# EAGLE schematic untitled (EAGLE 7.2.0)
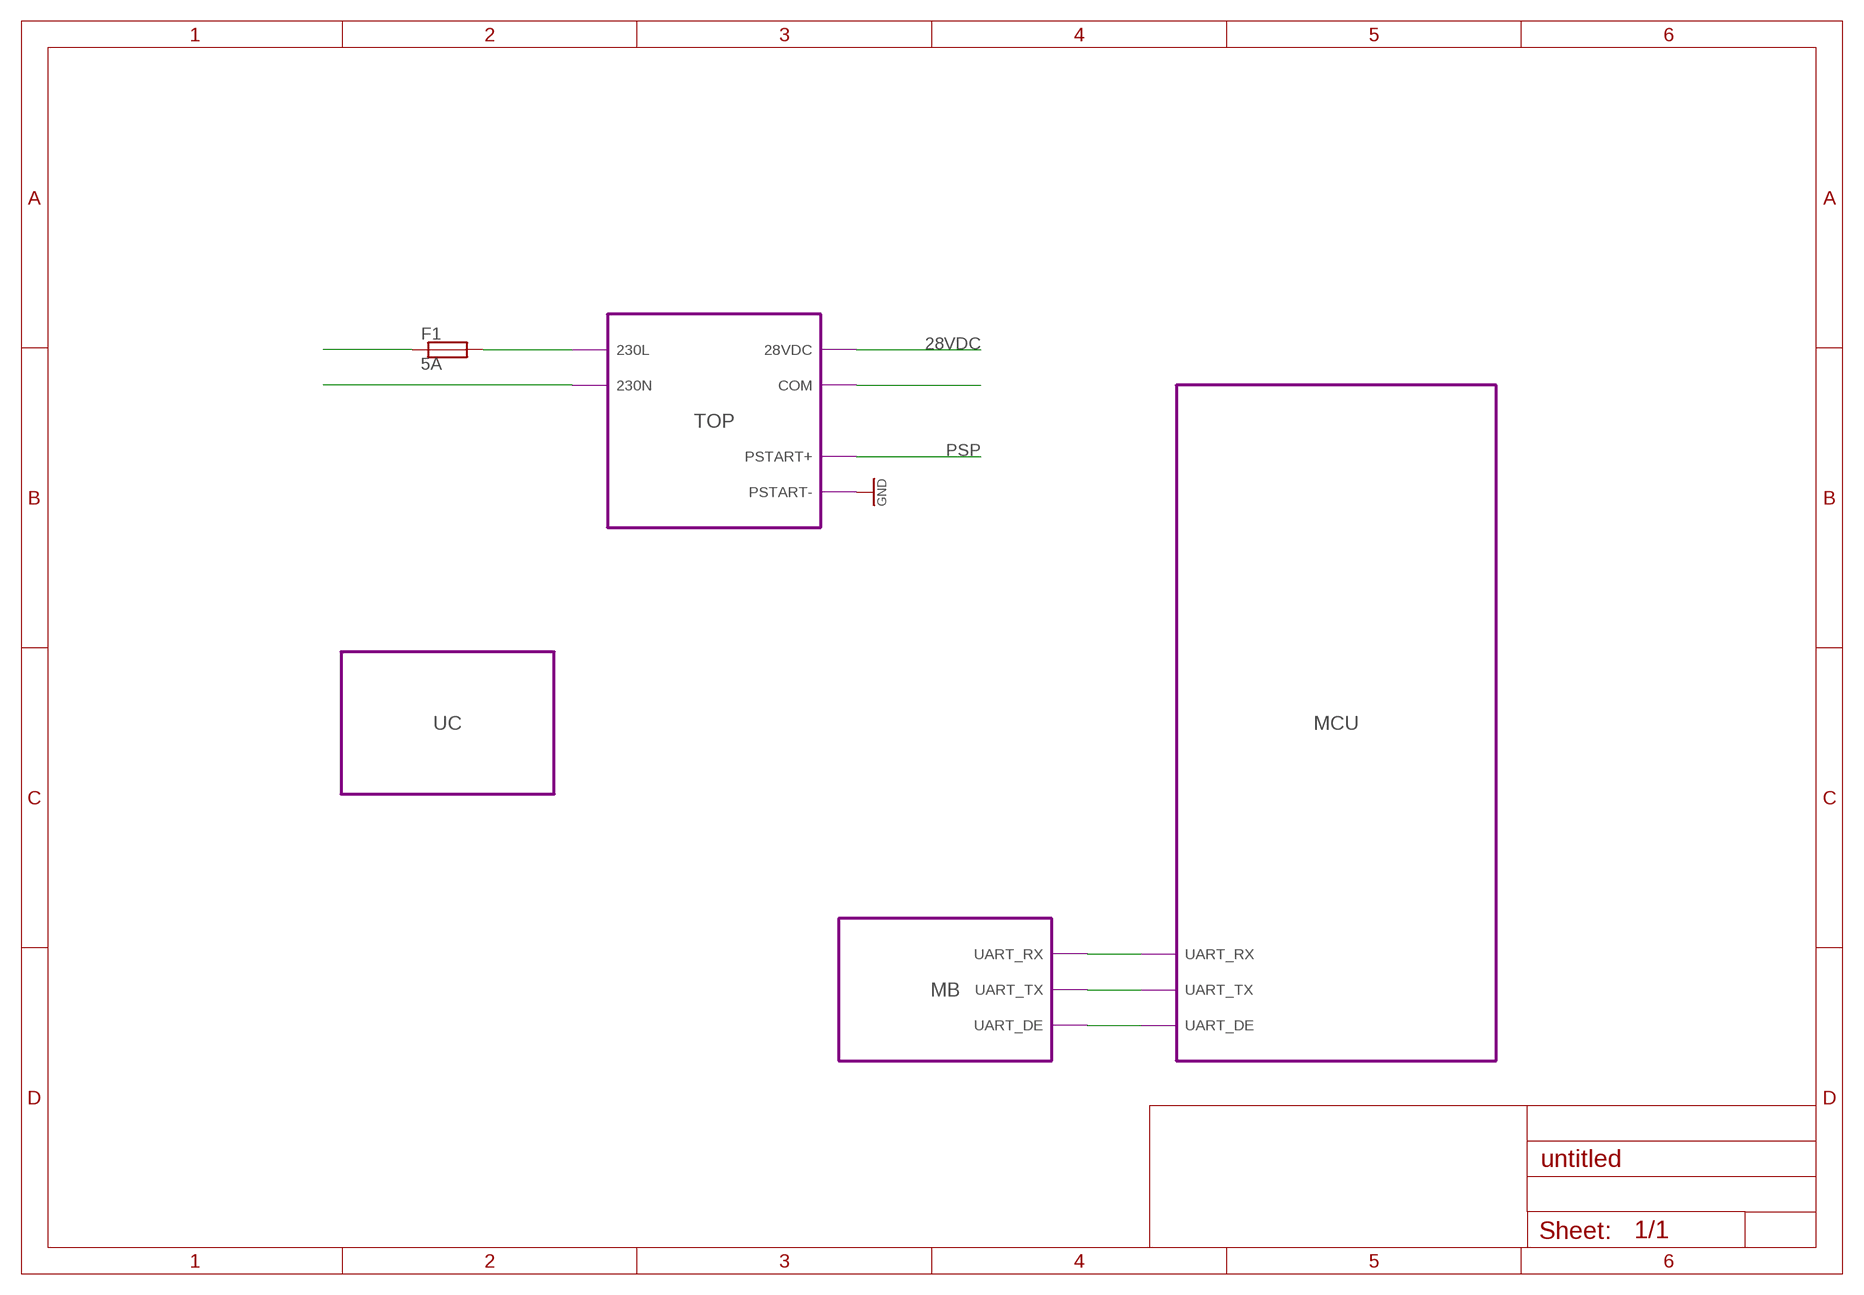
[diagram p0: schematic, sheet 1]

## Parts
F1  5A  FU-5A-SH22  [SH22]

## Module instances
TOP = TOP
MCU = MCU
MB = MB
UC = UC

## Nets
28VDC: port TOP.28VDC
GND: port TOP.PSTART-
N$1: F1.2 ; port TOP.230L
N$2: port TOP.230N
N$3: F1.1
N$4: port TOP.COM
N$5: port MB.UART_RX MCU.UART_RX
N$6: port MB.UART_TX MCU.UART_TX
N$7: port MB.UART_DE MCU.UART_DE
PSP: port TOP.PSTART+

## Library data of the parts
F1 = discr_lib:FU*: FUSE HOLDER CS PFP30, Schukat; DESC: Saugiklio lizdas; PACK_TYPE: DIP; PRICE: 0.20; VENT_CODE: ventcode

## Module TOP
Ports: 230L(pwr) 230N(pwr) PSTART+(in) PSTART-(in) 28VDC(pwr) COM(pwr)
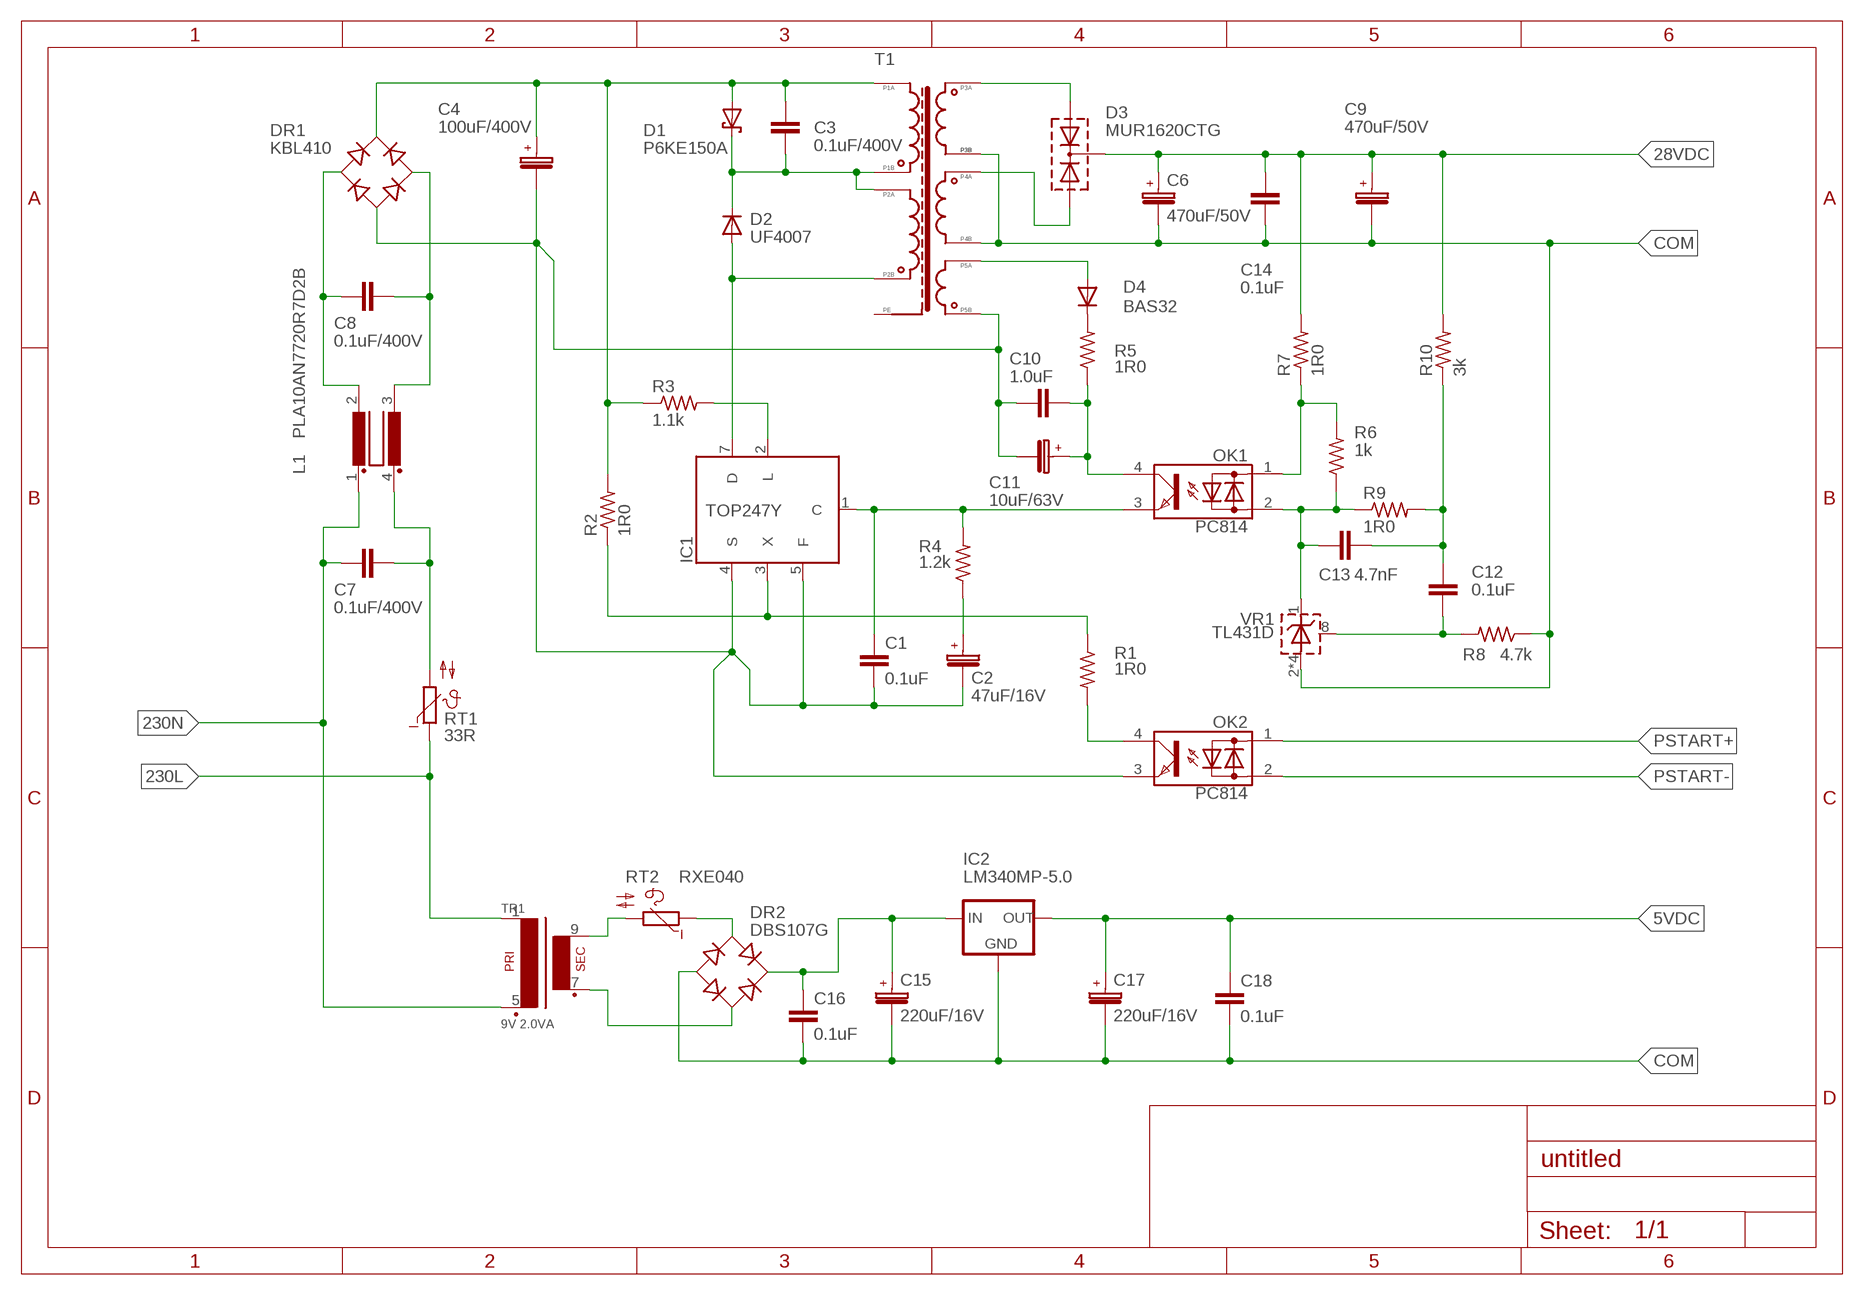
[diagram p1: schematic, module TOP, sheet 1]

### Parts
C1  0.1uF  C0805-0.1UF  [C0805]
C2  47uF/16V  CPOL/2.5X5-47UF/16V  [E2,5-5]
C3  0.1uF/400V  CC133/54-0.1UF-400V  [C102-054X133]
C4  100uF/400V  CPOL/10X22-100UF/400V  [EB22,5D]
C6  470uF/50V  CPOL/3.5X10-470UF/50V  [E3,5-10]
C7  0.1uF/400V  CC133/54-0.1UF-400V  [C102-054X133]
C8  0.1uF/400V  CC133/54-0.1UF-400V  [C102-054X133]
C9  470uF/50V  CPOL/3.5X10-470UF/50V  [E3,5-10]
C10  1.0uF  C1206-1UF  [C1206]
C11  10uF/63V  CPOL/2.5X5-10UF/63V  [E2,5-5]
C12  0.1uF  C0805-0.1UF  [C0805]
C13  4.7nF  C0805-4.7NF  [C0805]
C14  0.1uF  C0805-0.1UF  [C0805]
C15  220uF/16V  CPOL/3.5X8-220UF/16V  [E3,5-8]
C16  0.1uF  C0805-0.1UF  [C0805]
C17  220uF/16V  CPOL/3.5X8-220UF/16V  [E3,5-8]
C18  0.1uF  C0805-0.1UF  [C0805]
D1  P6KE150A  TVS-P6KE150A/C1702-15  [C1702-15]
D2  UF4007  DSW-UF4007/D41-10  [DO41-10]
D3  MUR1620CTG  2D-MUR1620-V  [TO220ABS]
D4  BAS32  DSW-BAS32/MINIMELF  [MINIMELF]
DR1  KBL410  DREC410/KBL  [KBL]
DR2  DBS107G  DREC-DBS107/DBS  [DBS]
IC1  TOP247Y  [TO220-7C]
IC2  LM340MP-5.0  LM340MP  [SOT223]
L1  PLA10AN7720R7D2B  LFMFE  [MFE]
OK1  PC814  OK-PC814  [DIL04]
OK2  PC814  OK-PC814  [DIL04]
R1  1R0  R-0805-1R0-1%  [R0805]
R2  1R0  R-0805-1R0-1%  [R0805]
R3  1.1k  R-0.6W-1.1K-1%  [0207/7]
R4  1.2k  R-0805-1.2K-5%  [R0805]
R5  1R0  R-0805-1R0-1%  [R0805]
R6  1k  R-0805-1K-1%  [R0805]
R7  1R0  R-0805-1R0-1%  [R0805]
R8  4.7k  R-0805-4.7K-1%  [R0805]
R9  1R0  R-0805-1R0-1%  [R0805]
R10  3k  R-0805-3K  [R0805]
RT1  33R  POLYSW-33R  [TABLETE_10]
RT2  RXE040  POLYSW-RXE040/B57164  [B57164]
T1  TI_­E25_­2X14_­86W  [E25-11-­K-­H-­13P_WZ2589]
TR1  9V 2.0VA  TP1S1-9V-2.0VA-1  [EI30]
VR1  TL431D  [SO-08]

### Nets
5VDC: C17.+ C18.1 IC2.3(OUT)
28VDC: C6.+ C9.+ C14.1 D3.2(C) R7.2 R10.2
230L: RT1.1 TR1.1
230N: C7.1 L1.1 TR1.5(P2)
COM: C6.- C9.- C14.2 C15.- C16.2 C17.- C18.2 DR2.- IC2.2(GND) IC2.4(GND) R8.1 T1.P$8(P4B) T1.P$9(P3B) VR1.2(A) VR1.3(A) VR1.6(A) VR1.7(A)
N$1: C3.2 D1.C D2.C T1.P$3(P1B) T1.P$4(P2A)
N$2: IC1.3(X) R1.1 R2.1
N$3: IC1.2(L) R3.2
N$4: C3.1 C4.+ D1.A DR1.+ R2.2 R3.1 T1.P$2(P1A)
N$5: C1.1 IC1.1(C) OK1.3(E) R4.2
N$6: C2.+ R4.1
N$7: OK2.4(C) R1.2
N$8: D2.A IC1.7(D) T1.P$6(P2B)
N$9: RT2.2 TR1.9(S4)
N$10: C7.2 L1.4 RT1.2
N$11: DR2.AC1 RT2.1
N$12: D3.3(A2) T1.P$12(P4A)
N$13: C8.2 DR1.AC2 L1.3
N$14: C8.1 DR1.AC1 L1.2
N$15: D3.1(A1) T1.P$13(P3A)
N$16: DR2.AC2 TR1.7(S3)
N$17: D4.C R5.2
N$18: D4.A T1.P$5(P5A)
N$19: C10.2 C11.+ OK1.4(C) R5.1
N$20: OK1.1(AC1) R6.2 R7.1
N$21: C13.1 OK1.2(AC2) R6.1 R9.1 VR1.1(C)
N$22: C1.2 C2.- C4.- C10.1 C11.- DR1.- IC1.4(S) IC1.5(F) OK2.3(E) T1.P$7(P5B)
N$23: C12.2 R8.2 VR1.8(R)
N$24: C12.1 C13.2 R9.2 R10.1
N$25: C15.+ C16.1 DR2.+ IC2.1(IN)
PSTART+: OK2.1(AC1)
PSTART-: OK2.2(AC2)
Unconnected: T1.P$1(PE)

### Library data of the parts
C1 C12 C14 C16 C18 = discr_lib:C?: Capacitor; DESC: Kondensatorius; PACK_TYPE: SMD; PARAMS: 50v; PRICE: 0.001; TYPE: X7R; VENT_CODE: ZKN065
C2 = discr_lib:CPOL?: Capacitor polar.; DESC: El. kondensatorius; PACK_TYPE: DIP; PRICE: 0.02; VENT_CODE: ventcode
C3 C7 C8 = discr_lib:C?: Capacitor; DESC: Kondensatorius; PACK_TYPE: DIP; PARAMS: 400V; PRICE: 0.11; VENT_CODE: ZKN001
C4 = discr_lib:CPOL?: Capacitor polar.; DESC: El. kondensatorius; PACK_TYPE: DIP; PRICE: 1.10; VENT_CODE: ZKN116
C6 C9 = discr_lib:CPOL?: Capacitor polar.; DESC: El. kondensatorius; PACK_TYPE: DIP; VENT_CODE: ZKN042
C10 = discr_lib:C?: Capacitor; DESC: Kondensatorius; PACK_TYPE: SMD; PRICE: 0.001; TYPE: X7R; VENT_CODE: ZKN062
C11 = discr_lib:CPOL?: Capacitor polar.; DESC: El. kondensatorius; PACK_TYPE: DIP; PRICE: 0.01; VENT_CODE: ZKN011
C13 = discr_lib:C?: Capacitor; DESC: Kondensatorius; PACK_TYPE: SMD; PARAMS: 50V; PRICE: 0.001; VENT_CODE: ventcode
C15 C17 = discr_lib:CPOL?: Capacitor polar.; DESC: El. kondensatorius; PACK_TYPE: DIP; PRICE: 0.02; VENT_CODE: ZKN041
D1 = discr_lib:TVS*: Supressor transient-voltage suppressor; DESC: TVS diodas; PACK_TYPE: DIP; PRICE: 0.06; TYPE: Supressor; VENT_CODE: ZELD011
D2 = discr_lib:DSW*: Switching diode; DESC: Diodas; PACK_TYPE: DIP; PARAMS: 1000V/1A/75ns; PRICE: 0.05; TYPE: Ultrafast switch; VENT_CODE: ZELD040
D3 = discr_lib:2D*: DIODE dual rectifier, 6 A, 200 V, common cathode; DESC: Diodas; PACK_TYPE: DIP; PARAMS: 200V/8A/60ns; PRICE: 0.368; TYPE: Ultrafast rectifier; VENT_CODE: ZELD051
D4 = discr_lib:DSW*: Switching diode; DESC: Diodas; PACK_TYPE: SMD; PARAMS: 75V/200mA/4ns; PRICE: 0.01; TYPE: Switch; VENT_CODE: ZELD003
DR1 = discr_lib:DREC*: Rectifier; DESC: Diodu tiltelis; PACK_TYPE: DIP; PARAMS: 1000V/4A; PRICE: 0.528; VENT_CODE: ZELD072
DR2 = discr_lib:DREC*: Rectifier; DESC: Diodu tiltelis; PACK_TYPE: SMD; PARAMS: 1000V/1A; PRICE: 0.07; VENT_CODE: ZELD022
IC1 = drivers_lib:TOP2*?: Integrated Off-line Switcher http://datasheet.octopart.com/TOP248YN-Power-Integrations-datasheet-337.pdf; DESC: Mikroschema; PACK_TYPE: DIP; PRICE: 2.41; VENT_CODE: ventcode
IC2 = vstab_lib:LM340: Stabilizatorius; DESC: Itampos stabilizatorius; PACK_TYPE: SMD; PARAMS: 1.5A; PRICE: 0.53; VENT_CODE: ZELM013
L1 = discr_lib:LF?: Common Mode Choke Coil; DESC: Filtro droselis; PACK_TYPE: DIP; PARAMS: 300VAC/0.7A/7.7mH; PRICE: 0.31; VENT_CODE: ZELI010
OK1 OK2 = discr_lib:OK*: Opto coupler; DESC: Optronas; PACK_TYPE: DIP; PRICE: 0.07; VENT_CODE: ZELM095
R1 R2 R5 R7 R9 = discr_lib:R?: Resistor; DESC: Rezistorius; PACK_TYPE: SMD; PARAMS: 1%; PRICE: 0.001; VENT_CODE: ZELRS073
R3 = discr_lib:R?: Resistor; DESC: Rezistorius; PACK_TYPE: DIP; PARAMS: 1%/0.6W; PRICE: 0.001; VENT_CODE: ZELR002
R4 = discr_lib:R?: Resistor; DESC: Rezistorius; PACK_TYPE: SMD; PARAMS: 5%; PRICE: 0.001; VENT_CODE: ventcode
R6 = discr_lib:R?: Resistor; DESC: Rezistorius; PACK_TYPE: SMD; PARAMS: 1%; PRICE: 0.001; VENT_CODE: ZELRS061
R8 = discr_lib:R?: Resistor; DESC: Rezistorius; PACK_TYPE: SMD; PARAMS: 1%; PRICE: 0.001; VENT_CODE: ZELRS053
R10 = discr_lib:R?: Resistor; DESC: Rezistorius; PACK_TYPE: SMD; PRICE: 0.001; VENT_CODE: ventcode
RT1 = discr_lib:POLYSW*: PTC & NTC, thermistors, varistors, etc.; DESC: NTC termistorius; PACK_TYPE: DIP; PRICE: 0.17; VENT_CODE: ZELR059
RT2 = discr_lib:POLYSW*: PTC & NTC, thermistors, varistors, etc.; DESC: PTC saugiklis; PACK_TYPE: DIP; PARAMS: 72V/400mA; PRICE: 0.10; TYPE: PTC; VENT_CODE: ZEL062
T1 = trafo_lib:TI_­E25_­2X14_­86W: Pulse transformer 2x14V 3A Datasheet: http://www.tme.eu/en/Document/d9d3e59666dfbe5542b71fc6020e4c92/1688.pdf; DESC: Imp. transformatorius; PACK_TYPE: DIP; PRICE: 5.69; VENT_CODE: ventcode
TR1 = trafo_lib:TP1S1: TRANSFORMER 1 primary winding, 1 secondary winding BLOCK; DESC: Transformatorius; PACK_TYPE: DIP; PARAMS: 9V/2.0VA; PRICE: 1.60; VENT_CODE: ZTR021
VR1 = vstab_lib:TL431*: VOLTAGE REGULATOR; DESC: Mikroschema; PACK_TYPE: SMD; PRICE: 0.20; VENT_CODE: ventcode

## Module MCU
Ports: UART_RX(in) UART_TX(out) UART_DE(out)
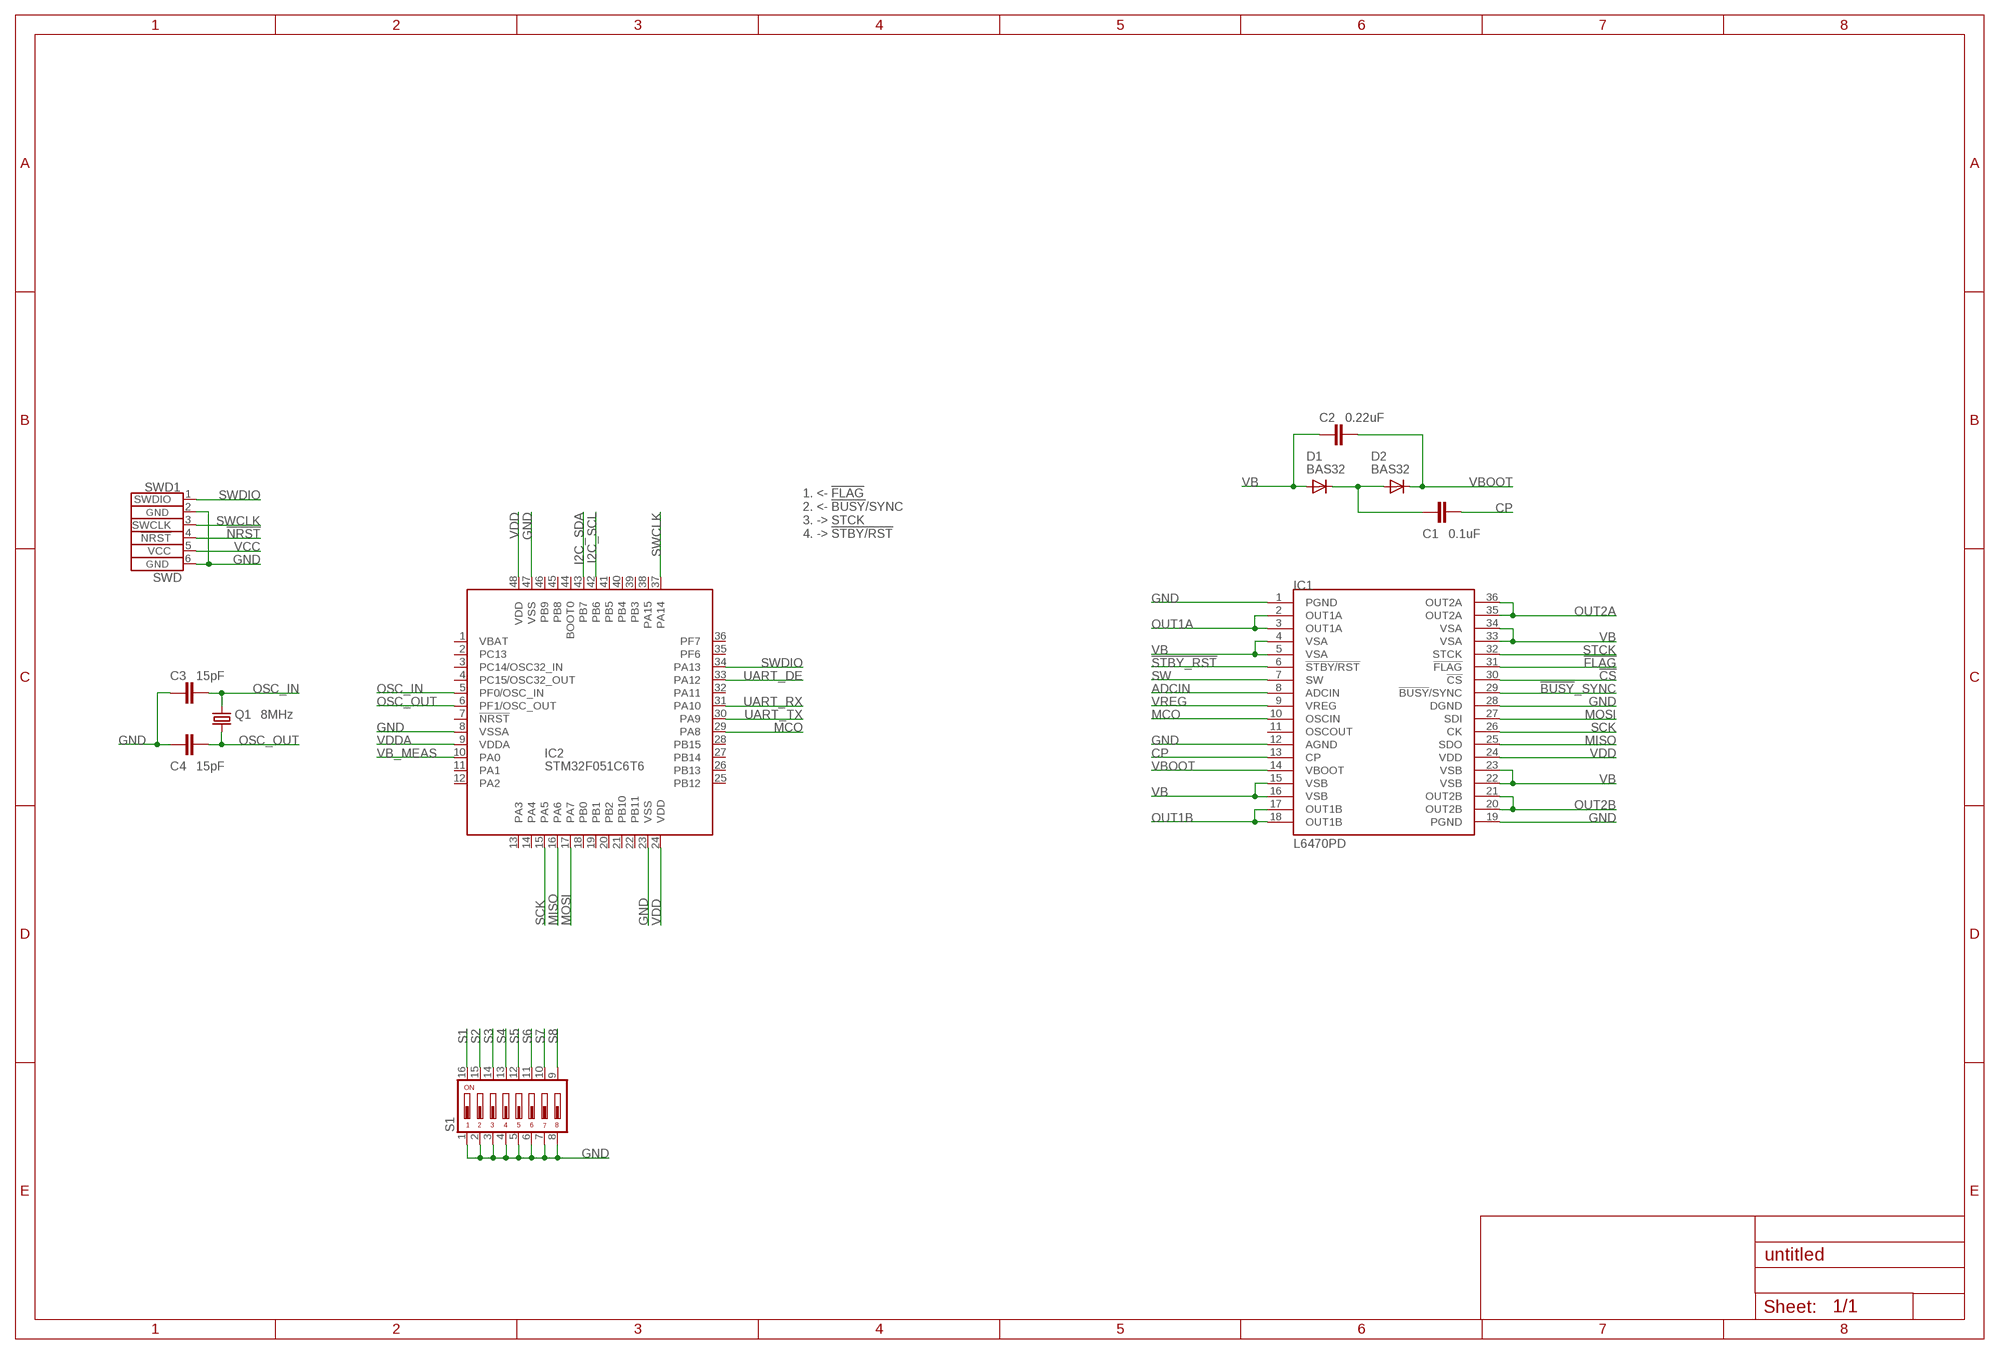
[diagram p2: schematic, module MCU, sheet 1]

### Parts
C1  0.1uF  C1206-0.1UF  [C1206]
C2  0.22uF  C1206-0.22UF  [C1206]
C3  15pF  C0805-15PF  [C0805]
C4  15pF  C0805-15PF  [C0805]
D1  BAS32  DSW-BAS32/MINIMELF  [MINIMELF]
D2  BAS32  DSW-BAS32/MINIMELF  [MINIMELF]
IC1  L6470PD  [POWERSO-36]
IC2  STM32F051C6T6  STM32F051C6T  [TQFP48]
Q1  8MHz  CRYSTAL-8MHZSMD  [HC49UP]
S1  DS08N  [DS-08]
SWD1  SWD  [ISP]

### Nets
!BUSY!_SYNC: IC1.29(!BUSY!/SYNC)
!CS: IC1.30(!CS)
!FLAG: IC1.31(!FLAG)
!NRST: SWD1.4(!NRST)
!STBY_RST: IC1.6(!STBY/RST)
ADCIN: IC1.8(ADCIN)
CP: C1.2 IC1.13(CP)
GND: C3.2 C4.2 IC1.1(PGND) IC1.12(AGND) IC1.19(PGND) IC1.28(DGND) IC2.8(VSSA) IC2.23(VSS) IC2.47(VSS) S1.1 S1.2 S1.3 S1.4 S1.5 S1.6 S1.7 S1.8 SWD1.2(GND) SWD1.6(GND)
I2C_SCL: IC2.42(PB6)
I2C_SDA: IC2.43(PB7)
MCO: IC1.10(OSCIN) IC2.29(PA8)
MISO: IC1.25(SDO) IC2.16(PA6)
MOSI: IC1.27(SDI) IC2.17(PA7)
N$1: C1.1 D1.C D2.A
OSC_IN: C3.1 IC2.5(PF0/OSC_IN) Q1.1
OSC_OUT: C4.1 IC2.6(PF1/OSC_OUT) Q1.2
OUT1A: IC1.2(OUT1A) IC1.3(OUT1A)
OUT1B: IC1.17(OUT1B) IC1.18(OUT1B)
OUT2A: IC1.35(OUT2A) IC1.36(OUT2A)
OUT2B: IC1.20(OUT2B) IC1.21(OUT2B)
S1: S1.16
S2: S1.15
S3: S1.14
S4: S1.13
S5: S1.12
S6: S1.11
S7: S1.10
S8: S1.9
SCK: IC1.26(CK) IC2.15(PA5)
STCK: IC1.32(STCK)
SW: IC1.7(SW)
SWCLK: IC2.37(PA14) SWD1.3(SWCLK)
SWDIO: IC2.34(PA13) SWD1.1(SWDIO)
UART_DE: IC2.33(PA12)
UART_RX: IC2.31(PA10)
UART_TX: IC2.30(PA9)
VB: C2.1 D1.A IC1.4(VSA) IC1.5(VSA) IC1.15(VSB) IC1.16(VSB) IC1.22(VSB) IC1.23(VSB) IC1.33(VSA) IC1.34(VSA)
VB_MEAS: IC2.10(PA0)
VBOOT: C2.2 D2.C IC1.14(VBOOT)
VCC: SWD1.5(VCC)
VDD: IC1.24(VDD) IC2.24(VDD) IC2.48(VDD)
VDDA: IC2.9(VDDA)
VREG: IC1.9(VREG)
Unconnected: IC1.11(OSCOUT) IC2.1(VBAT) IC2.2(PC13) IC2.3(PC14/OSC32_IN) IC2.4(PC15/OSC32_OUT) IC2.7(!NRST) IC2.11(PA1) IC2.12(PA2) IC2.13(PA3) IC2.14(PA4) IC2.18(PB0) IC2.19(PB1) IC2.20(PB2) IC2.21(PB10) IC2.22(PB11) IC2.25(PB12) IC2.26(PB13) IC2.27(PB14) IC2.28(PB15) IC2.32(PA11) IC2.35(PF6) IC2.36(PF7) IC2.38(PA15) IC2.39(PB3) IC2.40(PB4) IC2.41(PB5) IC2.44(BOOT0) IC2.45(PB8) IC2.46(PB9)

### Notes on the sheet
- 1. <- !FLAG!
  2. <- !BUSY!/SYNC
  3. -> STCK
  4. -> !STBY/RST!

### Library data of the parts
C1 = discr_lib:C?: Capacitor; DESC: Kondensatorius; PACK_TYPE: SMD; PRICE: 0.001; TYPE: X7R; VENT_CODE: ventcode
C2 = discr_lib:C?: Capacitor; DESC: Kondensatorius; PACK_TYPE: SMD; PRICE: 0.001; TYPE: X7R; VENT_CODE: ZKN003
C3 C4 = discr_lib:C?: Capacitor; DESC: Kondensatorius; PACK_TYPE: SMD; PARAMS: 50V; PRICE: 0.001; TYPE: X7R; VENT_CODE: ZKN097
D1 D2 = discr_lib:DSW*: Switching diode; DESC: Diodas; PACK_TYPE: SMD; PARAMS: 75V/200mA/4ns; PRICE: 0.01; TYPE: Switch; VENT_CODE: ZELD003
IC1 = ic_lib:L6470; DESC: Mikroschema; PACK_TYPE: SMD; PRICE: 4.50; VENT_CODE: ventcode
IC2 = mcu_lib:STM32F051C*?; DESC: Mikrokontrolleris; PACK_TYPE: SMD; PARAMS: FLASH 32 Kb; PRICE: 1.27; VENT_CODE: ventcode
Q1 = discr_lib:CRYSTAL*: Crystals Various standard crystals. Proven footprints. Spark Fun Electronics SKU : COM-00534; DESC: Rezonatorius; PACK_TYPE: SMD; VENT_CODE: ventcode
S1 = mech_lib:DS08: DIL/CODE SWITCH; DESC: Jungiklis; PACK_TYPE: DIP; VENT_CODE: ventcode
SWD1 = conn_lib:SWD: Jungtis; DESC: Jungtis; PACK_TYPE: DIP; PRICE: 0.00; VENT_CODE: ZAJ071

## Module MB
Ports: UART_RX(out) UART_TX(in) UART_DE(in)
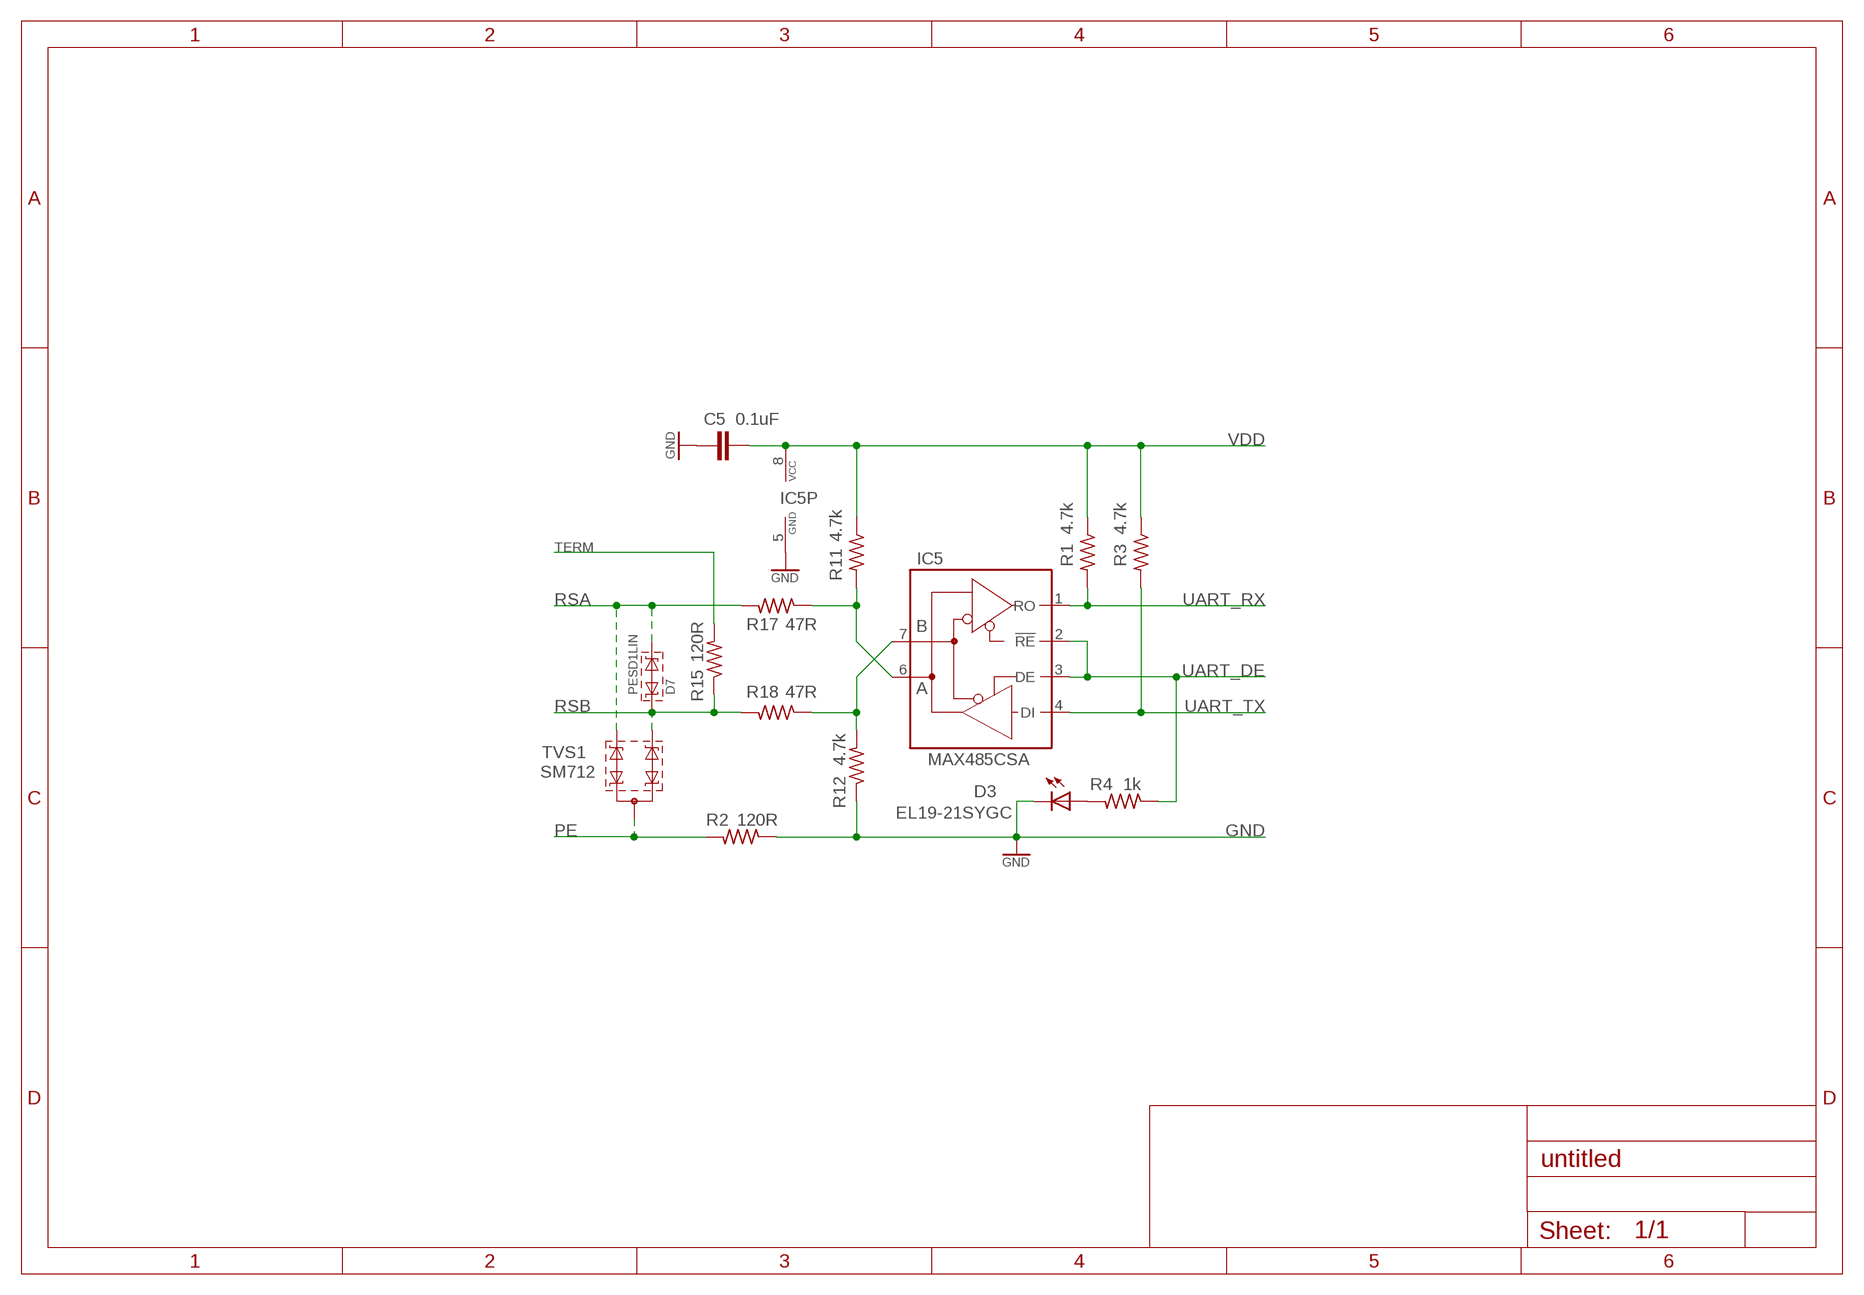
[diagram p3: schematic, module MB, sheet 1]

### Parts
C5  0.1uF  C0805-0.1UF  [C0805]
D3  EL19-21SYGC  LED-EL19-21SYGC-0805  [CHIPLED_0805]
D7  PESD1LIN  PESD5V0U1BA-R  [SOD323-R]
IC5  MAX485CSA  RS485-MAX485/SO08  [SO08]
R1  4.7k  R-0805-4.7K-1%  [R0805]
R2  120R  R-1206-120R-1%  [R1206]
R3  4.7k  R-0805-4.7K-1%  [R0805]
R4  1k  R-0805-1K-1%  [R0805]
R11  4.7k  R-0805-4.7K-1%  [R0805]
R12  4.7k  R-0805-4.7K-1%  [R0805]
R15  120R  R-0805-120R-1%  [R0805]
R17  47R  R-0805-47R-1%  [R0805]
R18  47R  R-0805-47R-1%  [R0805]
TVS1  SM712  [SOT23]

### Nets
GND: C5.2 D3.C IC5.5(GND) R2.1 R12.1
N$1: IC5.7(B) R12.2 R18.1
N$2: IC5.6(A) R11.2 R17.1
N$3: D3.A R4.2
PE: R2.2 TVS1.3
RSA: D7.C(C2) R17.2 TVS1.2
RSB: D7.A(C1) R15.1 R18.2 TVS1.1
TERM: R15.2
UART_DE: IC5.2(!RE) IC5.3(DE) R4.1
UART_RX: IC5.1(RO) R1.2
UART_TX: IC5.4(DI) R3.2
VDD: C5.1 IC5.8(VCC) R1.1 R3.1 R11.1

### Library data of the parts
C5 = discr_lib:C?: Capacitor; DESC: Kondensatorius; PACK_TYPE: SMD; PARAMS: 50v; PRICE: 0.001; TYPE: X7R; VENT_CODE: ZKN065
D3 = discr_lib:LED*: Light Emitter Diode; DESC: Sv. diodas; PACK_TYPE: SMD; PARAMS: Green; VENT_CODE: ZELD010
D7 = repeater:PESD5V0U1BA
IC5 = drivers_lib:RS485*: RS485 TRANSEIVER; DESC: Mikroschema; PACK_TYPE: SMD; VENT_CODE: ZELM048
R1 R3 R11 R12 = discr_lib:R?: Resistor; DESC: Rezistorius; PACK_TYPE: SMD; PARAMS: 1%; PRICE: 0.001; VENT_CODE: ZELRS053
R2 = discr_lib:R?: Resistor; DESC: Rezistorius; PACK_TYPE: SMD; PARAMS: 1%; PRICE: 0.001; VENT_CODE: ZELRS042
R4 = discr_lib:R?: Resistor; DESC: Rezistorius; PACK_TYPE: SMD; PARAMS: 1%; PRICE: 0.001; VENT_CODE: ZELRS061
R15 = discr_lib:R?: Resistor; DESC: Rezistorius; PACK_TYPE: SMD; PARAMS: 1%; PRICE: 0.001; VENT_CODE: ZELRS055
R17 R18 = discr_lib:R?: Resistor; DESC: Rezistorius; PACK_TYPE: SMD; PARAMS: 1%; PRICE: 0.001; VENT_CODE: ZELRS054
TVS1 = repeater:SM712

## Module UC
Ports: 
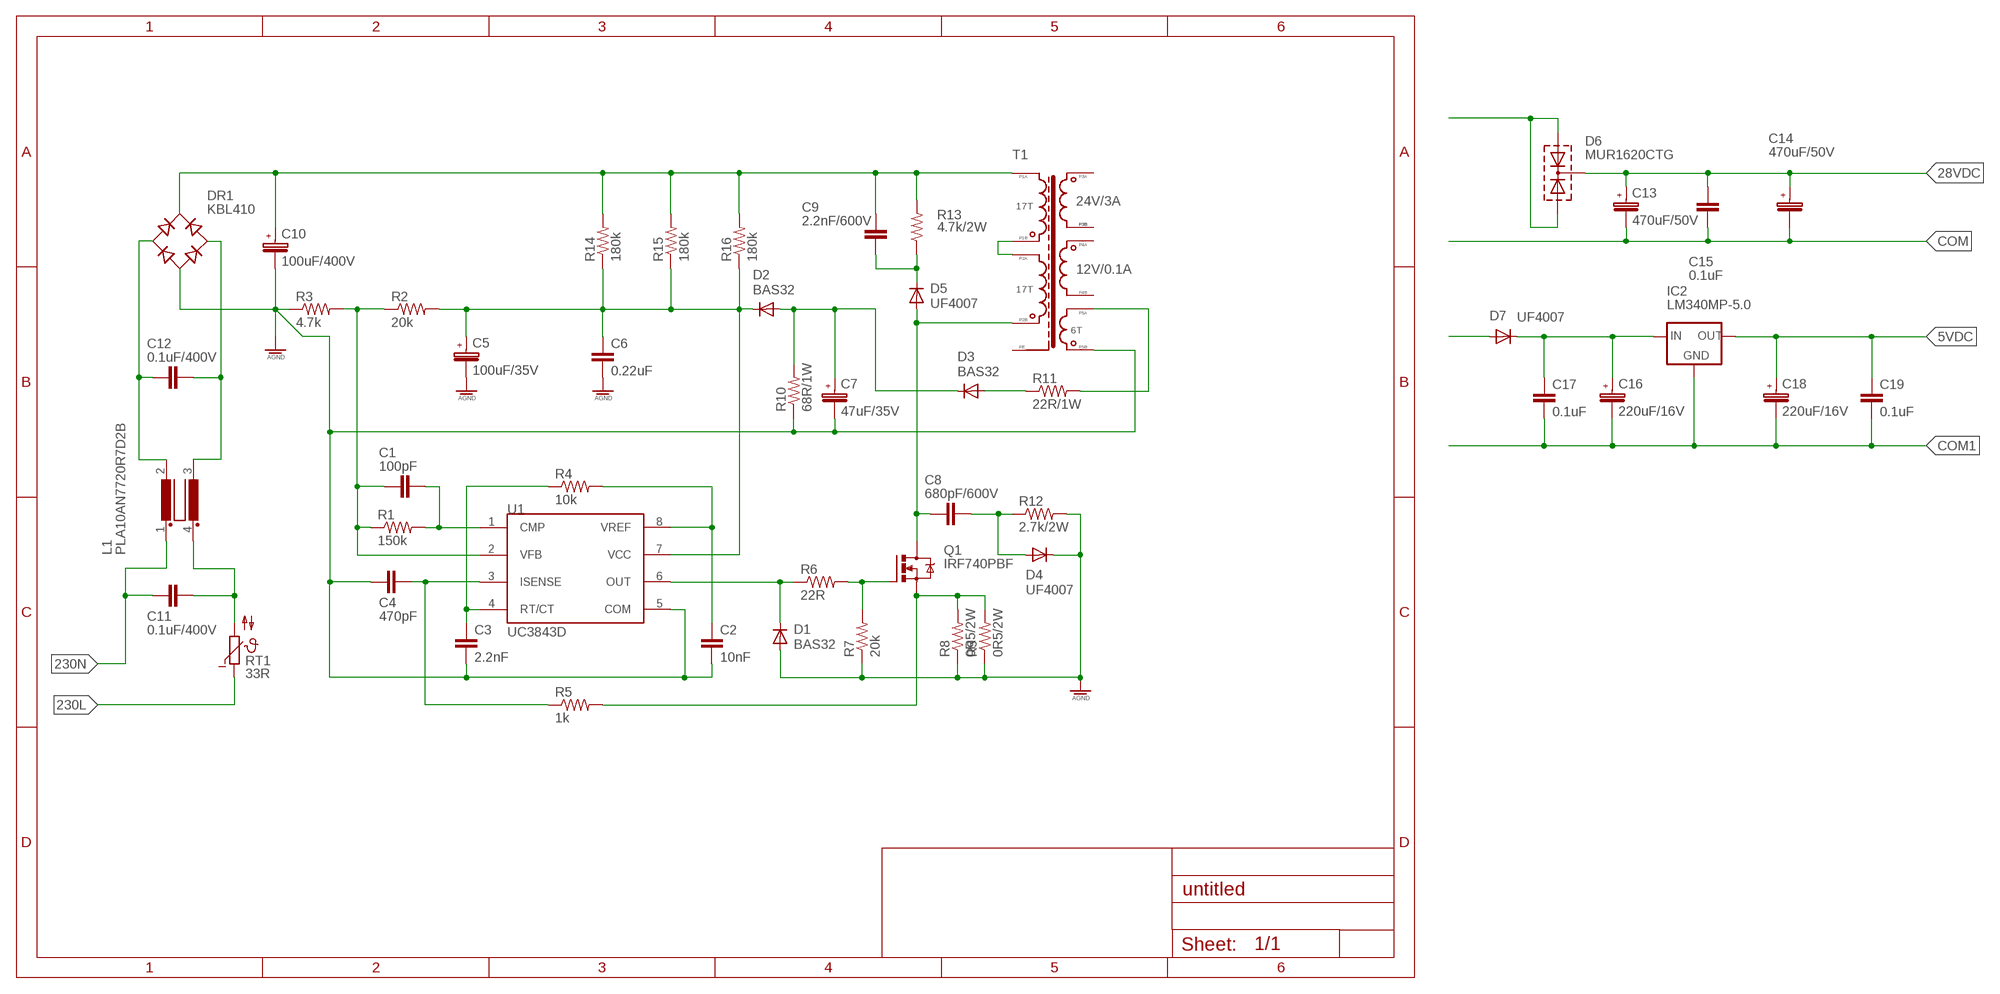
[diagram p4: schematic, module UC, sheet 1]

### Parts
C1  100pF  C0805-100PF  [C0805]
C2  10nF  C0805-10NF  [C0805]
C3  2.2nF  C0805-2.2NF  [C0805]
C4  470pF  C0805-470PF  [C0805]
C5  100uF/35V  CPOL/3.5X8-100UF/35V  [E3,5-8]
C6  0.22uF  C1206-0.22UF  [C1206]
C7  47uF/35V  CPOL/2.5X6-47UF/35V  [E2,5-6]
C8  680pF/600V  CC075/35-680PF-600V  [C050-035X075]
C9  2.2nF/600V  CC133/43-2.2NF-600V  [C102-043X133]
C10  100uF/400V  CPOL/10X22-100UF/400V  [EB22,5D]
C11  0.1uF/400V  CC133/54-0.1UF-400V  [C102-054X133]
C12  0.1uF/400V  CC133/54-0.1UF-400V  [C102-054X133]
C13  470uF/50V  CPOL/3.5X10-470UF/50V  [E3,5-10]
C14  470uF/50V  CPOL/3.5X10-470UF/50V  [E3,5-10]
C15  0.1uF  C0805-0.1UF  [C0805]
C16  220uF/16V  CPOL/3.5X8-220UF/16V  [E3,5-8]
C17  0.1uF  C0805-0.1UF  [C0805]
C18  220uF/16V  CPOL/3.5X8-220UF/16V  [E3,5-8]
C19  0.1uF  C0805-0.1UF  [C0805]
D1  BAS32  DSW-BAS32/MINIMELF  [MINIMELF]
D2  BAS32  DSW-BAS32/MINIMELF  [MINIMELF]
D3  BAS32  DSW-BAS32/MINIMELF  [MINIMELF]
D4  UF4007  DSW-UF4007/D41-10  [DO41-10]
D5  UF4007  DSW-UF4007/D41-10  [DO41-10]
D6  MUR1620CTG  2D-MUR1620-V  [TO220ABS]
D7  UF4007  DSW-UF4007/D41-10  [DO41-10]
DR1  KBL410  DREC410/KBL  [KBL]
IC2  LM340MP-5.0  LM340MP  [SOT223]
L1  PLA10AN7720R7D2B  LFMFE  [MFE]
Q1  IRF740PBF  MOSFET_N-IRF740-TO220V  [TO220BV]
R1  150k  R-0805-150K-1%  [R0805]
R2  20k  R-0805-20K-1%  [R0805]
R3  4.7k  R-0805-4.7K-1%  [R0805]
R4  10k  R-0805-10K-1%  [R0805]
R5  1k  R-0805-1K-1%  [R0805]
R6  22R  R-0805-22R-1%  [R0805]
R7  20k  R-0805-20K-1%  [R0805]
R8  0R5/2W  R-2.0W-0R5-1%  [0411/12]
R9  0R5/2W  R-2.0W-0R5-1%  [0411/12]
R10  68R/1W  R-1W-68R-1%  [0309/10]
R11  22R/1W  R-1W-22R-1%  [0309/10]
R12  2.7k/2W  R-2.0W-2.7K-1%  [0411/12]
R13  4.7k/2W  R-2.0W-4.7K-1%  [0411/12]
R14  180k  R-1206-180K-5%  [R1206]
R15  180k  R-1206-180K-5%  [R1206]
R16  180k  R-1206-180K-5%  [R1206]
RT1  33R  POLYSW-33R  [TABLETE_10]
T1  TI_­E25_­2X14_­86W  [E25-11-­K-­H-­13P_WZ2589]
U1  UC3843D  [SO08]

### Nets
5VDC: C18.+ C19.1 IC2.3(OUT)
28VDC: C13.+ C14.+ C15.1 D6.2(C)
230L: RT1.1
230N: C11.1 L1.1
AGND: C2.2 C3.2 C4.2 C5.- C6.2 C7.- C10.- D1.A D4.C DR1.- R3.1 R7.1 R8.1 R9.1 R10.1 R12.2 T1.P$7(P5B) U1.5(COM)
COM: C13.- C14.- C15.2
COM1: C16.- C17.2 C18.- C19.2 IC2.2(GND) IC2.4(GND)
N$1: C1.1 R1.1 R2.1 R3.2 U1.2(VFB)
N$2: C1.2 R1.2 U1.1(CMP)
N$3: C4.1 R5.1 U1.3(ISENSE)
N$4: D1.C R6.1 U1.6(OUT)
N$5: C5.+ C6.1 D2.C R2.2 R14.1 R15.1 R16.1 U1.7(VCC)
N$6: C7.+ D2.A D3.C R10.2
N$7: C3.1 R4.1 U1.4(RT/CT)
N$8: C2.1 R4.2 U1.8(VREF)
N$9: Q1.G R6.2 R7.2
N$10: Q1.S R5.2 R8.2 R9.2
N$11: C8.1 D5.A Q1.D T1.P$6(P2B)
N$12: T1.P$3(P1B) T1.P$4(P2A)
N$13: C9.1 C10.+ DR1.+ R13.2 R14.2 R15.2 R16.2 T1.P$2(P1A)
N$14: D3.A R11.1
N$15: R11.2 T1.P$5(P5A)
N$16: C8.2 D4.A R12.1
N$17: C9.2 D5.C R13.1
N$18: C11.2 L1.4 RT1.2
N$19: D6.1(A1) D6.3(A2)
N$20: C12.2 DR1.AC2 L1.3
N$21: C12.1 DR1.AC1 L1.2
N$22: D7.A
N$25: C16.+ C17.1 D7.C IC2.1(IN)
Unconnected: T1.P$1(PE) T1.P$8(P4B) T1.P$9(P3B) T1.P$12(P4A) T1.P$13(P3A)

### Notes on the sheet
- 24V/3A
- 17T
- 12V/0.1A
- 17T
- 6T

### Library data of the parts
C1 C3 = discr_lib:C?: Capacitor; DESC: Kondensatorius; PACK_TYPE: SMD; PARAMS: 50V; PRICE: 0.001; VENT_CODE: ventcode
C2 = discr_lib:C?: Capacitor; DESC: Kondensatorius; PACK_TYPE: SMD; PARAMS: 50V; PRICE: 0.001; TYPE: X7R; VENT_CODE: ZKN080
C4 = discr_lib:C?: Capacitor; DESC: Kondensatorius; PACK_TYPE: SMD; PARAMS: 50V; PRICE: 0.001; TYPE: X7R; VENT_CODE: ZKN087
C5 = discr_lib:CPOL?: Capacitor polar.; DESC: El. kondensatorius; PACK_TYPE: DIP; PRICE: 0.03; VENT_CODE: ZKN104
C6 = discr_lib:C?: Capacitor; DESC: Kondensatorius; PACK_TYPE: SMD; PRICE: 0.001; TYPE: X7R; VENT_CODE: ZKN003
C7 = discr_lib:CPOL?: Capacitor polar.; DESC: El. kondensatorius; PACK_TYPE: DIP; VENT_CODE: ZKN113
C8 = discr_lib:C?: Capacitor; DESC: Kondensatorius; PACK_TYPE: DIP; PARAMS: 600V; PRICE: 0.00; VENT_CODE: ZKN114
C9 = discr_lib:C?: Capacitor; DESC: Kondensatorius; PACK_TYPE: DIP; PARAMS: 600V; VENT_CODE: ZKN115
C10 = discr_lib:CPOL?: Capacitor polar.; DESC: El. kondensatorius; PACK_TYPE: DIP; PRICE: 1.10; VENT_CODE: ZKN116
C11 C12 = discr_lib:C?: Capacitor; DESC: Kondensatorius; PACK_TYPE: DIP; PARAMS: 400V; PRICE: 0.11; VENT_CODE: ZKN001
C13 C14 = discr_lib:CPOL?: Capacitor polar.; DESC: El. kondensatorius; PACK_TYPE: DIP; VENT_CODE: ZKN042
C15 C17 C19 = discr_lib:C?: Capacitor; DESC: Kondensatorius; PACK_TYPE: SMD; PARAMS: 50v; PRICE: 0.001; TYPE: X7R; VENT_CODE: ZKN065
C16 C18 = discr_lib:CPOL?: Capacitor polar.; DESC: El. kondensatorius; PACK_TYPE: DIP; PRICE: 0.02; VENT_CODE: ZKN041
D1-D3 = discr_lib:DSW*: Switching diode; DESC: Diodas; PACK_TYPE: SMD; PARAMS: 75V/200mA/4ns; PRICE: 0.01; TYPE: Switch; VENT_CODE: ZELD003
D4 D5 D7 = discr_lib:DSW*: Switching diode; DESC: Diodas; PACK_TYPE: DIP; PARAMS: 1000V/1A/75ns; PRICE: 0.05; TYPE: Ultrafast switch; VENT_CODE: ZELD040
D6 = discr_lib:2D*: DIODE dual rectifier, 6 A, 200 V, common cathode; DESC: Diodas; PACK_TYPE: DIP; PARAMS: 200V/8A/60ns; PRICE: 0.368; TYPE: Ultrafast rectifier; VENT_CODE: ZELD051
DR1 = discr_lib:DREC*: Rectifier; DESC: Diodu tiltelis; PACK_TYPE: DIP; PARAMS: 1000V/4A; PRICE: 0.528; VENT_CODE: ZELD072
IC2 = vstab_lib:LM340: Stabilizatorius; DESC: Itampos stabilizatorius; PACK_TYPE: SMD; PARAMS: 1.5A; PRICE: 0.53; VENT_CODE: ZELM013
L1 = discr_lib:LF?: Common Mode Choke Coil; DESC: Filtro droselis; PACK_TYPE: DIP; PARAMS: 300VAC/0.7A/7.7mH; PRICE: 0.31; VENT_CODE: ZELI010
Q1 = discr_lib:MOSFET_N*: N-CHANNEL MOS FET; DESC: Tranzistorius; PACK_TYPE: DIP; PARAMS: 400V/0.55Ohm/10A; PRICE: 0.7; TYPE: MOSFET; VENT_CODE: ZELT030
R1 R2 R4 R6 R7 = discr_lib:R?: Resistor; DESC: Rezistorius; PACK_TYPE: SMD; PARAMS: 1%; PRICE: 0.001; VENT_CODE: ventcode
R3 = discr_lib:R?: Resistor; DESC: Rezistorius; PACK_TYPE: SMD; PARAMS: 1%; PRICE: 0.001; VENT_CODE: ZELRS053
R5 = discr_lib:R?: Resistor; DESC: Rezistorius; PACK_TYPE: SMD; PARAMS: 1%; PRICE: 0.001; VENT_CODE: ZELRS061
R8 R9 = discr_lib:R?: Resistor; DESC: Rezistorius; PACK_TYPE: DIP; PARAMS: 1%/2W; PRICE: 0.01; VENT_CODE: ventcode
R10 = discr_lib:R?: Resistor; DESC: Rezistorius; PACK_TYPE: DIP; PARAMS: 1%/1W; PRICE: 0.01; VENT_CODE: ZELR085
R11 = discr_lib:R?: Resistor; DESC: Rezistorius; PACK_TYPE: DIP; PARAMS: 1%/1W; PRICE: 0.01; VENT_CODE: ZELR056
R12 = discr_lib:R?: Resistor; DESC: Rezistorius; PACK_TYPE: DIP; PARAMS: 1%/2W; PRICE: 0.01; VENT_CODE: ZLR086
R13 = discr_lib:R?: Resistor; DESC: Rezistorius; PACK_TYPE: DIP; PARAMS: 1%/2W; PRICE: 0.01; VENT_CODE: ZLR087
R14-R16 = discr_lib:R?: Resistor; DESC: Rezistorius; PACK_TYPE: SMD; PARAMS: 1%; PRICE: 0.001; VENT_CODE: ZELRS074
RT1 = discr_lib:POLYSW*: PTC & NTC, thermistors, varistors, etc.; DESC: NTC termistorius; PACK_TYPE: DIP; PRICE: 0.17; VENT_CODE: ZELR059
T1 = trafo_lib:TI_­E25_­2X14_­86W: Pulse transformer 2x14V 3A Datasheet: http://www.tme.eu/en/Document/d9d3e59666dfbe5542b71fc6020e4c92/1688.pdf; DESC: Imp. transformatorius; PACK_TYPE: DIP; PRICE: 5.69; VENT_CODE: ventcode
U1 = ic_lib:UC384*: High Performance Current Mode Controller http://datasheet.octopart.com/UC3843BD1R2G-ON-Semiconductor-datasheet-159697.pdf; DESC: Mikroschema; PACK_TYPE: SMD; PRICE: 0.34; VENT_CODE: ZELM138

## Net classes
0 default: clearance 0.2 mm
1 power: clearance 0.305 mm to class 0, clearance 0.305 mm